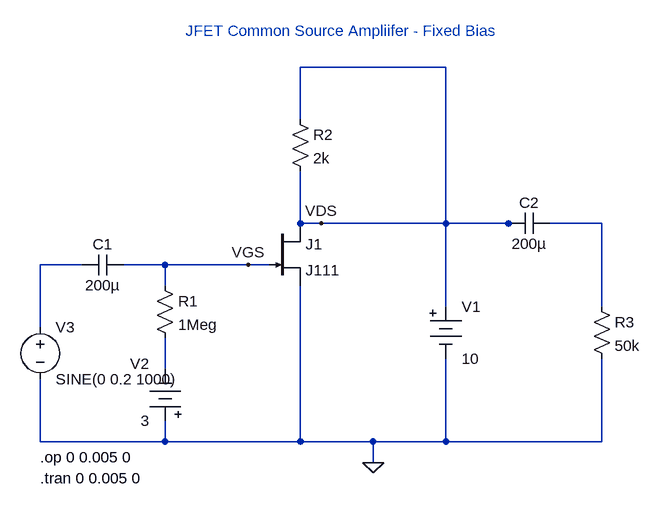
[diagram p0: schematic 2EEB_VELASCO_EXPT9_CKT1.asc]
2EEB_VELASCO_EXPT9_CKT1.asc, the LTspice schematic file:
Version 4
SHEET 1 1060 680
WIRE 752 -256 528 -256
WIRE 528 -176 528 -256
WIRE 528 -16 528 -96
WIRE 560 -16 528 -16
WIRE 752 -16 752 -256
WIRE 752 -16 560 -16
WIRE 848 -16 752 -16
WIRE 864 -16 848 -16
WIRE 992 -16 912 -16
WIRE 192 48 128 48
WIRE 320 48 256 48
WIRE 448 48 320 48
WIRE 480 48 448 48
WIRE 320 80 320 48
WIRE 752 112 752 -16
WIRE 992 112 992 -16
WIRE 128 144 128 48
WIRE 320 208 320 160
WIRE 128 320 128 224
WIRE 320 320 320 288
WIRE 320 320 128 320
WIRE 528 320 528 80
WIRE 528 320 320 320
WIRE 640 320 528 320
WIRE 752 320 752 192
WIRE 752 320 640 320
WIRE 992 320 992 192
WIRE 992 320 752 320
WIRE 640 352 640 320
FLAG 640 352 0
FLAG 448 48 VGS
FLAG 560 -16 VDS
SYMBOL res 304 64 R0
SYMATTR InstName R1
SYMATTR Value 1Meg
SYMBOL njf 480 -16 R0
SYMATTR InstName J1
SYMATTR Value J111
SYMBOL voltage 128 128 R0
SYMATTR InstName V3
SYMATTR Value SINE(0 0.2 1000)
SYMBOL cap 256 32 R90
WINDOW 0 0 32 VBottom 2
WINDOW 3 32 32 VTop 2
SYMATTR InstName C1
SYMATTR Value 200µ
SYMBOL Misc\\battery 752 96 R0
SYMATTR InstName V1
SYMATTR Value 10
SYMBOL cap 912 -32 R90
WINDOW 0 0 32 VBottom 2
WINDOW 3 32 32 VTop 2
SYMATTR InstName C2
SYMATTR Value 200µ
SYMBOL res 976 96 R0
SYMATTR InstName R3
SYMATTR Value 50k
SYMBOL res 512 -192 R0
SYMATTR InstName R2
SYMATTR Value 2k
SYMBOL Misc\\battery 320 304 R180
WINDOW 0 24 104 Left 2
WINDOW 3 24 16 Left 2
SYMATTR InstName V2
SYMATTR Value 3
TEXT 352 -312 Left 2 ;JFET Common Source Ampliifer - Fixed Bias
TEXT 128 344 Left 2 !.op 0 0.005 0
TEXT 128 376 Left 2 !.tran 0 0.005 0

The netlist it stands for:
* 2EEB_VELASCO_EXPT9_CKT1.asc
R1 VGS N003 1Meg
J1 VDS VGS 0 J111
V3 N002 0 SINE(0 0.2 1000)
C1 VGS N002 200µ
V1 VDS 0 10
C2 N001 VDS 200µ
R3 N001 0 50k
R2 VDS VDS 2k
V2 0 N003 3
.model NJF NJF
.model PJF PJF
.lib standard.jft
* JFET Common Source Ampliifer - Fixed Bias
.op 0 0.005 0
.tran 0 0.005 0
.backanno
.end